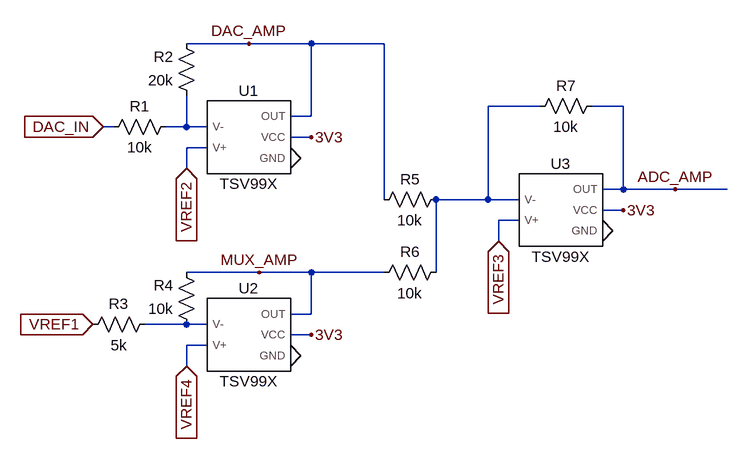
[diagram p0: schematic Simulation_AFE.asc]
Simulation_AFE.asc, the LTspice schematic file:
Version 4
SHEET 1 880 692
WIRE 128 48 32 48
WIRE 224 48 128 48
WIRE 336 48 224 48
WIRE 576 144 496 144
WIRE 704 144 656 144
WIRE 224 160 224 48
WIRE 224 160 192 160
WIRE -80 176 -96 176
WIRE 32 176 32 128
WIRE 32 176 0 176
WIRE 64 176 32 176
WIRE 224 192 192 192
WIRE 64 208 32 208
WIRE 32 240 32 208
WIRE 704 272 704 144
WIRE 704 272 672 272
WIRE 784 272 704 272
WIRE 864 272 784 272
WIRE 336 288 336 48
WIRE 496 288 496 144
WIRE 496 288 416 288
WIRE 544 288 496 288
WIRE 704 304 672 304
WIRE 544 320 512 320
WIRE 512 352 512 320
WIRE 144 400 32 400
WIRE 224 400 144 400
WIRE 336 400 224 400
WIRE 416 400 416 288
WIRE 224 464 224 400
WIRE 224 464 192 464
WIRE 32 480 -32 480
WIRE 64 480 32 480
WIRE 224 496 192 496
WIRE 64 512 32 512
WIRE 32 544 32 512
FLAG 192 224 0
FLAG -96 176 DAC_IN
IOPIN -96 176 In
FLAG 32 240 VREF2
IOPIN 32 240 In
FLAG 224 192 3V3
FLAG 128 48 DAC_AMP
FLAG -112 480 VREF1
IOPIN -112 480 In
FLAG 224 496 3V3
FLAG 192 528 0
FLAG 32 544 VREF4
IOPIN 32 544 In
FLAG 144 400 MUX_AMP
FLAG 512 352 VREF3
IOPIN 512 352 In
FLAG 672 336 0
FLAG 704 304 3V3
FLAG 784 272 ADC_AMP
SYMBOL AutoGenerated\\TSV99X 128 192 R0
SYMATTR InstName U1
SYMBOL res 16 160 R90
WINDOW 0 0 56 VBottom 2
WINDOW 3 32 56 VTop 2
SYMATTR InstName R1
SYMATTR Value 10k
SYMBOL res 48 144 R180
WINDOW 0 36 76 Left 2
WINDOW 3 36 40 Left 2
SYMATTR InstName R2
SYMATTR Value 20k
SYMBOL res -16 464 R90
WINDOW 0 0 56 VBottom 2
WINDOW 3 32 56 VTop 2
SYMATTR InstName R3
SYMATTR Value 5k
SYMBOL AutoGenerated\\TSV99X 128 496 R0
SYMATTR InstName U2
SYMBOL res 48 496 R180
WINDOW 0 36 76 Left 2
WINDOW 3 36 40 Left 2
SYMATTR InstName R4
SYMATTR Value 10k
SYMBOL AutoGenerated\\TSV99X 608 304 R0
SYMATTR InstName U3
SYMBOL res 432 272 R90
WINDOW 0 0 56 VBottom 2
WINDOW 3 32 56 VTop 2
SYMATTR InstName R5
SYMATTR Value 10k
SYMBOL res 432 384 R90
WINDOW 0 0 56 VBottom 2
WINDOW 3 32 56 VTop 2
SYMATTR InstName R6
SYMATTR Value 10k
SYMBOL res 560 160 R270
WINDOW 0 32 56 VTop 2
WINDOW 3 0 56 VBottom 2
SYMATTR InstName R7
SYMATTR Value 10k

The netlist it stands for:
* Simulation_AFE.asc
XU1 N002 VREF2 DAC_AMP 3V3 0 TSV99X  ; pins V- V+ OUT VCC GND
R1 N002 DAC_IN 10k
R2 N002 DAC_AMP 20k
R3 N003 VREF1 5k
XU2 N003 VREF4 MUX_AMP 3V3 0 TSV99X  ; pins V- V+ OUT VCC GND
R4 N003 MUX_AMP 10k
XU3 N001 VREF3 ADC_AMP 3V3 0 TSV99X  ; pins V- V+ OUT VCC GND
R5 N001 DAC_AMP 10k
R6 N001 MUX_AMP 10k
R7 N001 ADC_AMP 10k
.lib D:\Github\LTSpice\LTS0000 - Models\TSX631.mod
.backanno
.end